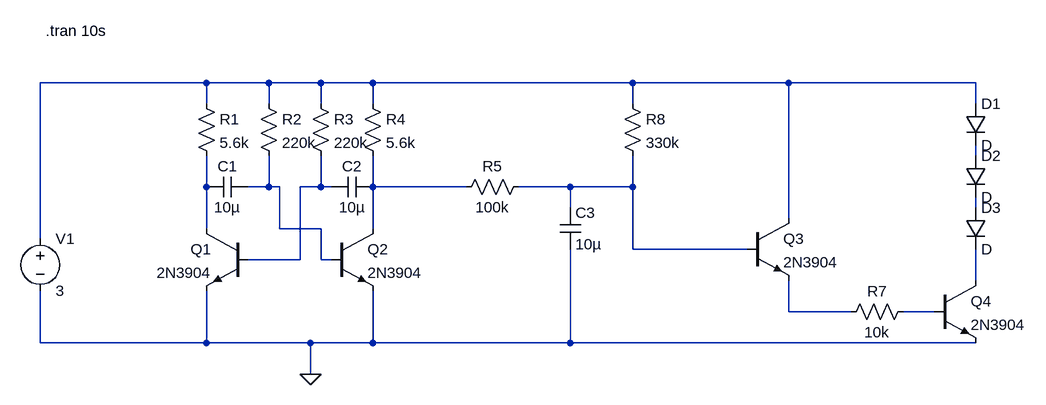
[diagram p0: schematic pulsing_LED_schematic.asc]
pulsing_LED_schematic.asc, the LTspice schematic file:
Version 4
SHEET 1 1400 680
WIRE 128 -128 -128 -128
WIRE 224 -128 128 -128
WIRE 304 -128 224 -128
WIRE 384 -128 304 -128
WIRE 784 -128 384 -128
WIRE 1024 -128 784 -128
WIRE 1312 -128 1024 -128
WIRE 128 -96 128 -128
WIRE 224 -96 224 -128
WIRE 304 -96 304 -128
WIRE 384 -96 384 -128
WIRE 784 -96 784 -128
WIRE 1312 -96 1312 -128
WIRE 1312 -16 1312 -32
WIRE 128 32 128 -16
WIRE 224 32 224 -16
WIRE 224 32 192 32
WIRE 240 32 224 32
WIRE 304 32 304 -16
WIRE 304 32 272 32
WIRE 320 32 304 32
WIRE 384 32 384 -16
WIRE 528 32 384 32
WIRE 688 32 608 32
WIRE 784 32 784 -16
WIRE 784 32 688 32
WIRE 688 64 688 32
WIRE 1312 64 1312 48
WIRE 1024 80 1024 -128
WIRE 128 96 128 32
WIRE 240 96 240 32
WIRE 304 96 240 96
WIRE 384 96 384 32
WIRE -128 112 -128 -128
WIRE 784 128 784 32
WIRE 960 128 784 128
WIRE 272 144 272 32
WIRE 272 144 192 144
WIRE 304 144 304 96
WIRE 320 144 304 144
WIRE 1312 176 1312 128
WIRE 1024 224 1024 176
WIRE 1120 224 1024 224
WIRE 1248 224 1200 224
WIRE -128 272 -128 192
WIRE 128 272 128 192
WIRE 128 272 -128 272
WIRE 288 272 128 272
WIRE 384 272 384 192
WIRE 384 272 288 272
WIRE 688 272 688 128
WIRE 688 272 384 272
WIRE 1312 272 688 272
WIRE 288 320 288 272
FLAG 288 320 0
SYMBOL npn 192 96 M0
SYMATTR InstName Q1
SYMATTR Value 2N3904
SYMBOL npn 320 96 R0
SYMATTR InstName Q2
SYMATTR Value 2N3904
SYMBOL voltage -128 96 R0
WINDOW 123 0 0 Left 0
WINDOW 39 0 0 Left 0
SYMATTR InstName V1
SYMATTR Value 3
SYMBOL res 112 -112 R0
SYMATTR InstName R1
SYMATTR Value 5.6k
SYMBOL res 208 -112 R0
SYMATTR InstName R2
SYMATTR Value 220k
SYMBOL res 288 -112 R0
SYMATTR InstName R3
SYMATTR Value 220k
SYMBOL res 368 -112 R0
SYMATTR InstName R4
SYMATTR Value 5.6k
SYMBOL cap 192 16 R90
WINDOW 0 0 32 VBottom 2
WINDOW 3 32 32 VTop 2
SYMATTR InstName C1
SYMATTR Value 10µ
SYMBOL cap 384 16 R90
WINDOW 0 0 32 VBottom 2
WINDOW 3 32 32 VTop 2
SYMATTR InstName C2
SYMATTR Value 10µ
SYMBOL res 624 16 R90
WINDOW 0 0 56 VBottom 2
WINDOW 3 32 56 VTop 2
SYMATTR InstName R5
SYMATTR Value 100k
SYMBOL cap 672 64 R0
SYMATTR InstName C3
SYMATTR Value 10µ
SYMBOL npn 960 80 R0
SYMATTR InstName Q3
SYMATTR Value 2N3904
SYMBOL npn 1248 176 R0
SYMATTR InstName Q4
SYMATTR Value 2N3904
SYMBOL diode 1296 -96 R0
SYMATTR InstName D1
SYMBOL diode 1296 -16 R0
SYMATTR InstName D2
SYMBOL diode 1296 64 R0
SYMATTR InstName D3
SYMBOL res 1216 208 R90
WINDOW 0 0 56 VBottom 2
WINDOW 3 32 56 VTop 2
SYMATTR InstName R7
SYMATTR Value 10k
SYMBOL res 768 -112 R0
SYMATTR InstName R8
SYMATTR Value 330k
TEXT -120 -208 Left 2 !.tran 10s

The netlist it stands for:
* pulsing_LED_schematic.asc
Q1 N003 N005 0 0 2N3904
Q2 N006 N004 0 0 2N3904
V1 N001 0 3
R1 N001 N003 5.6k
R2 N001 N004 220k
R3 N001 N005 220k
R4 N001 N006 5.6k
C1 N004 N003 10µ
C2 N006 N005 10µ
R5 N007 N006 100k
C3 N007 0 10µ
Q3 N001 N007 N010 0 2N3904
Q4 N009 N011 0 0 2N3904
D1 N001 N002 D
D2 N002 N008 D
D3 N008 N009 D
R7 N011 N010 10k
R8 N001 N007 330k
.model D D
.lib standard.dio
.model NPN NPN
.model PNP PNP
.lib standard.bjt
.tran 10s
.backanno
.end